# Altium project v1.5 Project.PrjPcb
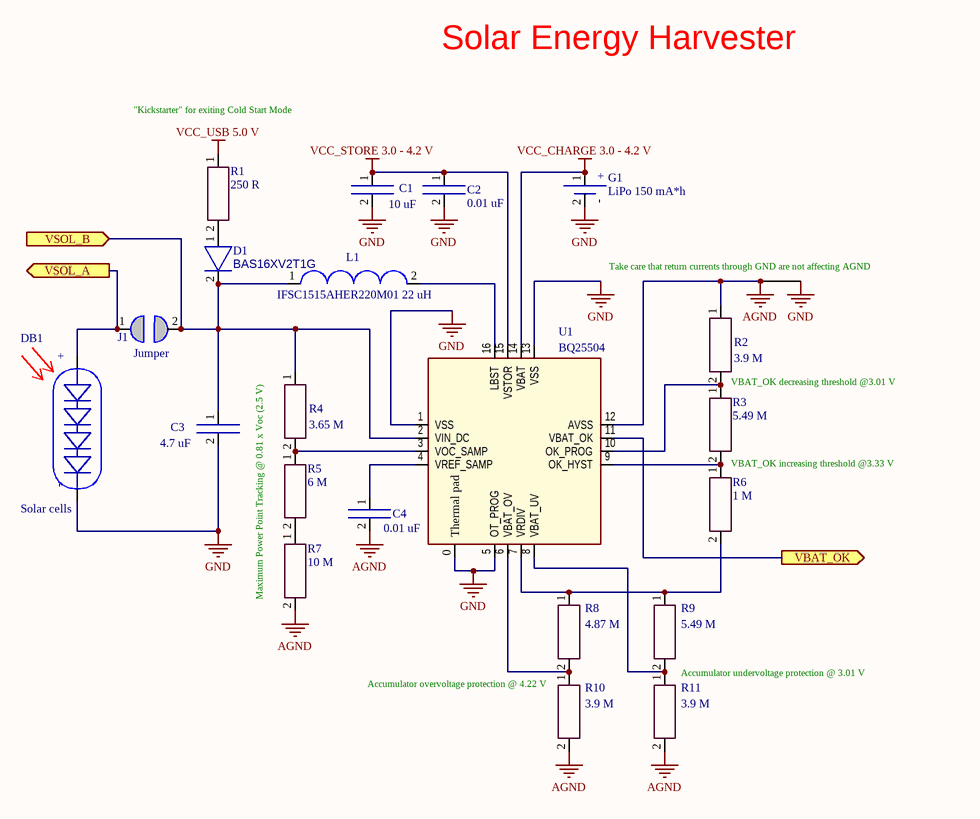
[diagram p0: v1.5 Solar.SchDoc]
3 sheets, 41 parts. Net scope: flat (ports and power ports of the same name join across sheets).
Board files: Stencil.PcbDoc, v1.5 PCB.PcbDoc, v1.5 PCB For Assembly Sheme.PcbDoc
Sheets:
  v1.5 Solar.SchDoc
  v1.5 Power.SchDoc
  v1.5 IMU & Baro.SchDoc

## Sheet v1.5 Solar.SchDoc
size A4; DocumentNumber: 1; SheetNumber: 1

### Parts
C1  10 uF  [0603]
C2  0.01 uF  [0402]
C3  4.7 uF  [0402]
C4  0.01 uF  [0402]
D1  BAS16XV2T1G  [SOD-523]
DB1  Solar cells  [Solar cells]  (no BOM)
G1  LiPo 150 mA*h  [LPV551230]  (no BOM)
J1  Jumper  [0603 - Jumper]  (no BOM)
L1  IFSC1515AHER220M01 22 uH  [IFSC1515-AH-01]
NET_TIE1  (no value)  [Net Tie]  (net tie, no BOM)
R1  250 R  [0402]
R2  3.9 M  [0402]
R3  5.49 M  [0402]
R4  3.65 M  [0402]
R5  6 M  [0402]
R6  1 M  [0402]
R7  10 M  [0402]
R8  4.87 M  [0402]
R9  5.49 M  [0402]
R10  3.9 M  [0402]
R11  3.9 M  [0402]
U1  BQ25504  [BQ25504]

### Ports
VBAT_OK (out), VSOL_A (out), VSOL_B (in)

### Nets
AGND: C4.2 NET_TIE1.1 R2.1 R7.2 R10.2 R11.2 U1.12(AVSS)
GND: C1.2 C2.2 C3.2 G1.2 NET_TIE1.2 U1.0(Thermal_pad) U1.1(VSS) U1.5(OT_PROG) U1.13(VSS)
VCC_CHARGE 3.0 - 4.2 V: G1.1 U1.14(VBAT)
VCC_STORE 3.0 - 4.2 V: C1.1 C2.1 U1.15(VSTOR)
VCC_USB 5.0 V: R1.1
NetC3_1: C3.1 D1.2 J1.2 L1.1 R4.1 U1.2(VIN_DC) ; port VSOL_B
NetC4_1: C4.1 U1.4(VREF_SAMP)
NetD1_1: D1.1 R1.2
NetJ1_1: J1.1 ; port VSOL_A
NetL1_2: L1.2 U1.16(LBST)
NetR2_2: R2.2 R3.1 U1.10(OK_PROG)
NetR3_2: R3.2 R6.1 U1.9(OK_HYST)
NetR4_2: R4.2 R5.1 U1.3(VOC_SAMP)
NetR5_2: R5.2 R7.1
NetR6_2: R6.2 R8.1 R9.1 U1.7(VRDIV)
NetR8_2: R8.2 R10.1 U1.6(VBAT_OV)
NetR9_2: R9.2 R11.1 U1.8(VBAT_UV)
NetR12_1: U1.11(VBAT_OK) ; port VBAT_OK

### Notes on the sheet
- Solar Energy Harvester
- (near R1) "Kickstarter" for exiting Cold Start Mode
- (near NET_TIE1) Take care that return currents through GND are not affecting AGND
- VBAT_OK decreasing threshold @3.01 V
- VBAT_OK increasing threshold @3.33 V
- Maximum Power Point Tracking @ 0.81 x Voc (2.5 V)
- (near R10) Accumulator overvoltage protection @ 4.22 V
- Accumulator undervoltage protection @ 3.01 V
- (in symbol Accumulator) +; -
- (in symbol Solar cells) +; -

### Library data of the parts
C1-C4 = Capasistor
D1 = Diode
G1 = Accumulator
L1 = Inductor
NET_TIE1 = Net Tie
R1-R11 = Resistor

## Sheet v1.5 Power.SchDoc
size A4; DocumentNumber: 2; SheetNumber: 2
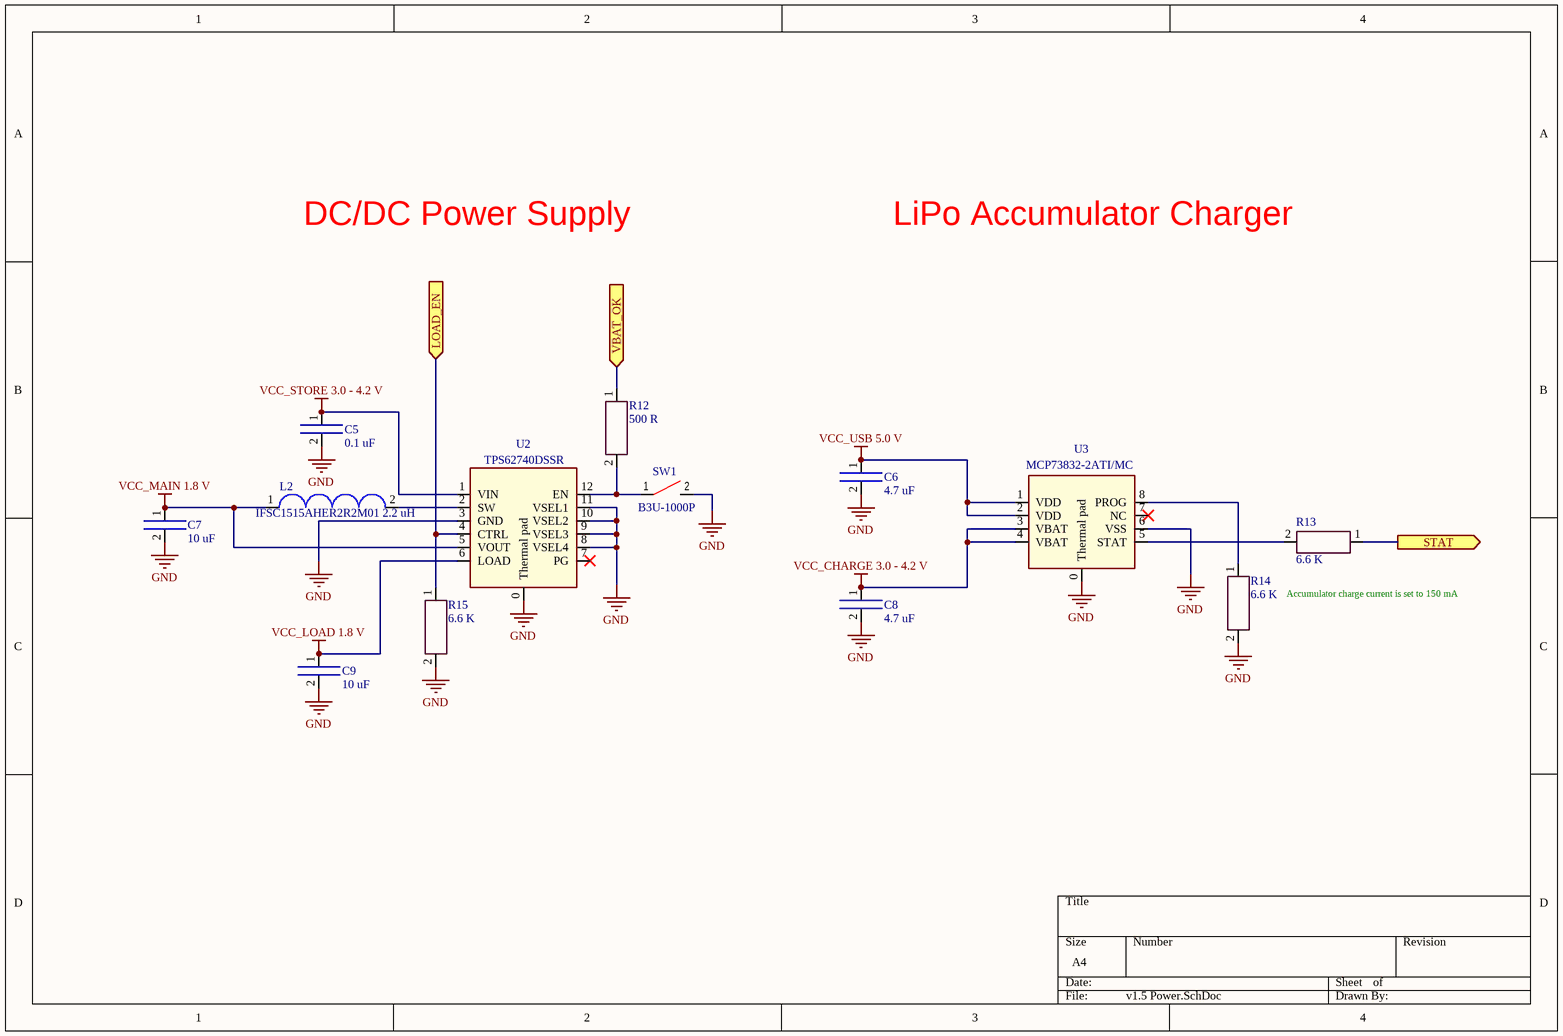
[diagram p1: v1.5 Power.SchDoc]

### Parts
C5  0.1 uF  [0402]
C6  4.7 uF  [0402]
C7  10 uF  [0603]
C8  4.7 uF  [0402]
C9  10 uF  [0603]
L2  IFSC1515AHER2R2M01 2.2 uH  [IFSC1515-AH-01]
R12  500 R  [0402]
R13  6.6 K  [0402]
R14  6.6 K  [0402]
R15  6.6 K  [0402]
SW1  B3U-1000P  [B3U-1000P]
U2  TPS62740DSSR  [TPS62740]
U3  MCP73832-2ATI/MC  [MCP73832-2ATI/MC]

### Ports
LOAD_EN (in), STAT (out), VBAT_OK (in)

### Nets
GND: C5.2 C6.2 C7.2 C8.2 C9.2 R14.2 R15.2 SW1.2 U2.0(Thermal_pad) U2.3(GND) U2.8(VSEL4) U2.9(VSEL3) U2.10(VSEL2) U2.11(VSEL1) U3.0(Thermal_pad) U3.6(VSS)
VCC_CHARGE 3.0 - 4.2 V: C8.1 U3.3(VBAT) U3.4(VBAT)
VCC_LOAD 1.8 V: C9.1 U2.6(LOAD)
VCC_MAIN 1.8 V: C7.1 L2.1 U2.5(VOUT)
VCC_STORE 3.0 - 4.2 V: C5.1 U2.1(VIN)
VCC_USB 5.0 V: C6.1 U3.1(VDD) U3.2(VDD)
NetL2_2: L2.2 U2.2(SW)
NetR12_1: R12.1 ; port VBAT_OK
NetR12_2: R12.2 SW1.1 U2.12(EN)
NetR13_1: R13.1 ; port STAT
NetR13_2: R13.2 U3.5(STAT)
NetR14_1: R14.1 U3.8(PROG)
NetR15_1: R15.1 U2.4(CTRL) ; port LOAD_EN

Not connected (* = marked no-connect by the designer): U2 7(PG)*; U3 7(NC)*

### Notes on the sheet
- DC/DC Power Supply
- LiPo Accumulator Charger
- Accumulator charge current is set to 150 mA

### Library data of the parts
C5-C9 = Capasistor
L2 = Inductor
R12-R15 = Resistor
SW1 = Tact switch
U2 = TPS62740

## Sheet v1.5 IMU & Baro.SchDoc
size A4; DocumentNumber: 6; SheetNumber: 6
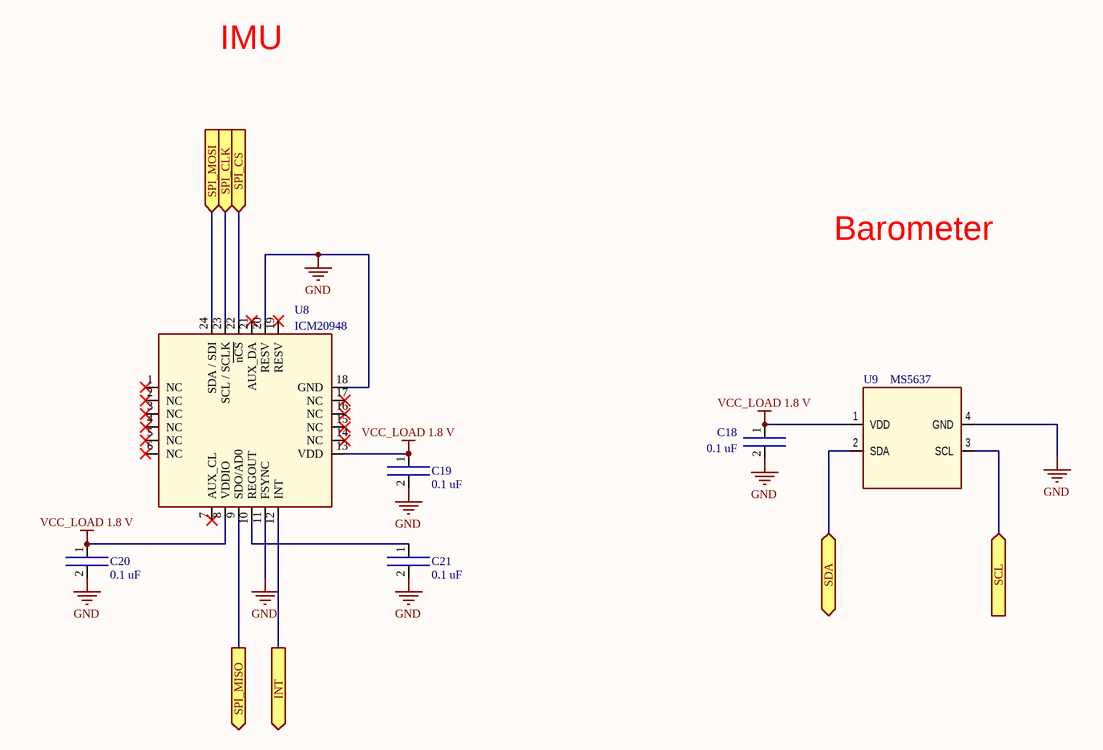
[diagram p2: v1.5 IMU & Baro.SchDoc]

### Parts
C18  0.1 uF  [0402]
C19  0.1 uF  [0402]
C20  0.1 uF  [0402]
C21  0.1 uF  [0402]
U8  ICM20948  [ICM20948]
U9  MS5637  [MS5637-02BA03]

### Ports
INT (out), SCL (in), SDA (bidir), SPI_CLK (in), SPI_CS (in), SPI_MISO (out), SPI_MOSI (in)

### Nets
GND: C18.2 C19.2 C20.2 C21.2 U8.11(FSYNC) U8.18(GND) U8.20(RESV) U9.4(GND)
VCC_LOAD 1.8 V: C18.1 C19.1 C20.1 U8.8(VDDIO) U8.13(VDD) U9.1(VDD)
NetC21_1: C21.1 U8.10(REGOUT)
NetU8_9: U8.9(SDO/AD0) ; port SPI_MISO
NetU8_12: U8.12(INT) ; port INT
NetU8_22: U8.22(~{nCS}) ; port SPI_CS
NetU8_23: U8.23(SCL_/_SCLK) ; port SPI_CLK
NetU8_24: U8.24(SDA_/_SDI) ; port SPI_MOSI
NetU9_2: U9.2(SDA) ; port SDA
NetU9_3: U9.3(SCL) ; port SCL

Not connected (* = marked no-connect by the designer): U8 1(NC)* 2(NC)* 3(NC)* 4(NC)* 5(NC)* 6(NC)* 7(AUX_CL)* 14(NC)* 15(NC)* 16(NC)* 17(NC)* 19(RESV)* 21(AUX_DA)*

### Notes on the sheet
- IMU
- Barometer

### Library data of the parts
C18-C21 = Capasistor
U9 = MS5637-02BA03

## Nets that join several sheets
GND: v1.5 Solar (9 pins), v1.5 Power (16 pins), v1.5 IMU & Baro (8 pins)
VCC_CHARGE 3.0 - 4.2 V: v1.5 Solar (G1.1 U1.14), v1.5 Power (C8.1 U3.3 U3.4)
VCC_LOAD 1.8 V: v1.5 Power (C9.1 U2.6), v1.5 IMU & Baro (6 pins)
VCC_STORE 3.0 - 4.2 V: v1.5 Solar (C1.1 C2.1 U1.15), v1.5 Power (C5.1 U2.1)
VCC_USB 5.0 V: v1.5 Solar (R1.1), v1.5 Power (C6.1 U3.1 U3.2)
NetR12_1: v1.5 Solar (U1.11), v1.5 Power (R12.1)